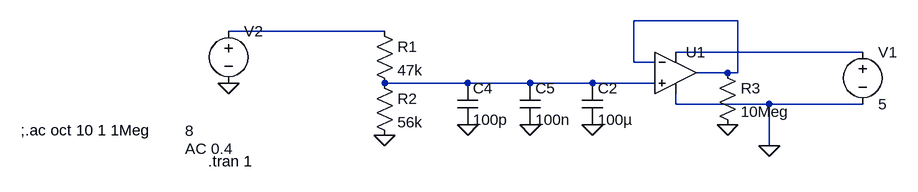
[diagram p0: schematic vbat-divider.asc]
vbat-divider.asc, the LTspice schematic file:
Version 4
SHEET 1 1392 680
WIRE 704 -48 544 -48
WIRE 160 -32 -80 -32
WIRE 896 0 608 0
WIRE 544 16 544 -48
WIRE 576 16 544 16
WIRE 688 32 640 32
WIRE 704 32 704 -48
WIRE 704 32 688 32
WIRE 288 48 160 48
WIRE 384 48 288 48
WIRE 480 48 384 48
WIRE 576 48 480 48
WIRE 608 80 608 64
WIRE 752 80 608 80
WIRE 896 80 752 80
WIRE 752 144 752 80
FLAG -80 48 0
FLAG 160 128 0
FLAG 752 144 0
FLAG 688 112 0
FLAG 480 112 0
FLAG 288 112 0
FLAG 384 112 0
SYMBOL res 144 -48 R0
SYMATTR InstName R1
SYMATTR Value 47k
SYMBOL res 144 32 R0
SYMATTR InstName R2
SYMATTR Value 56k
SYMBOL voltage 896 -16 R0
WINDOW 123 0 0 Left 2
WINDOW 39 0 0 Left 2
SYMATTR InstName V1
SYMATTR Value 5
SYMBOL voltage -80 -48 R0
WINDOW 3 -67 169 Left 2
WINDOW 123 -67 197 Left 2
WINDOW 39 0 0 Left 2
SYMATTR Value 8
SYMATTR Value2 AC 0.4
SYMATTR InstName V2
SYMBOL res 672 16 R0
SYMATTR InstName R3
SYMATTR Value 10Meg
SYMBOL cap 464 48 R0
SYMATTR InstName C2
SYMATTR Value 100µ
SYMBOL cap 272 48 R0
SYMATTR InstName C4
SYMATTR Value 100p
SYMBOL cap 368 48 R0
SYMATTR InstName C5
SYMATTR Value 100n
SYMBOL Opamps\\UniversalOpamp2 608 32 R0
SYMATTR InstName U1
TEXT -112 168 Left 2 !.tran 1
TEXT -400 120 Left 2 !;.ac oct 10 1 1Meg

The netlist it stands for:
* vbat-divider.asc
R1 N002 N004 47k
R2 N004 0 56k
V1 N003 0 5
V2 N002 0 8 AC 0.4
R3 N001 0 10Meg
C2 N004 0 100µ
C4 N004 0 100p
C5 N004 0 100n
XU1 N004 N001 N003 0 N001 level.2 Avol=1Meg GBW=10Meg Slew=10Meg ilimit=25m rail=0 Vos=0 phimargin=45 en=0 enk=0 in=0 ink=0 Rin=500Meg  ; pins IN+ IN- V+ V- OUT
.tran 1
;.ac oct 10 1 1Meg
.lib UniversalOpamps2.sub
.backanno
.end